# Altium project ESP_Infidel.PrjPcb
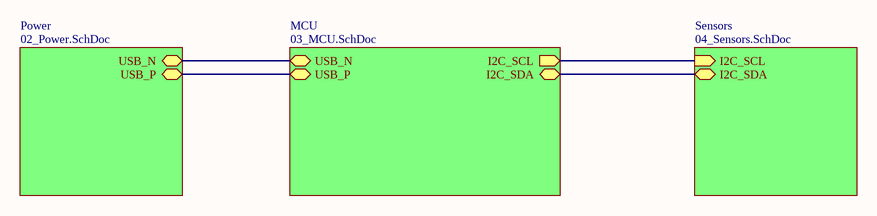
[diagram p0: 01_Top.SchDoc]
4 sheets, 47 parts. Net scope: hierarchical (ports join the sheet entries above them; power ports are global).
Board file: ESP_Infidel_PCB.PcbDoc
Sheets:
  01_Top.SchDoc
    Power = 02_Power.SchDoc
    MCU = 03_MCU.SchDoc
    Sensors = 04_Sensors.SchDoc

## Sheet 01_Top.SchDoc: OpenCamera Slider - Top level schematic
size A4; SheetNumber: 1; SheetTotal: 4; sk_ProjectName: WInFiDEL Sensor; sk_Title: Overview

### Sub-sheets
MCU = 03_MCU.SchDoc: USB_N (bidir), USB_P (bidir), I2C_SCL (out), I2C_SDA (bidir)
Power = 02_Power.SchDoc: USB_N (bidir), USB_P (bidir)
Sensors = 04_Sensors.SchDoc: I2C_SCL (in), I2C_SDA (bidir)

### Nets
I2C_SCL: sheet MCU/I2C_SCL, sheet Sensors/I2C_SCL
I2C_SDA: sheet MCU/I2C_SDA, sheet Sensors/I2C_SDA
USB_N: sheet Power/USB_P, sheet MCU/USB_P
USB_P: sheet Power/USB_N, sheet MCU/USB_N

### Notes on the sheet
- Page
- Title
- www.SasaKaranovic.com <http://www.SasaKaranovic.com>
- of

## Sheet 02_Power.SchDoc: OpenCamera Slider - Power
size A4; SheetNumber: 2; SheetTotal: 4; sk_ProjectName: WInFiDEL Sensor; sk_Title: Power and USB Connector
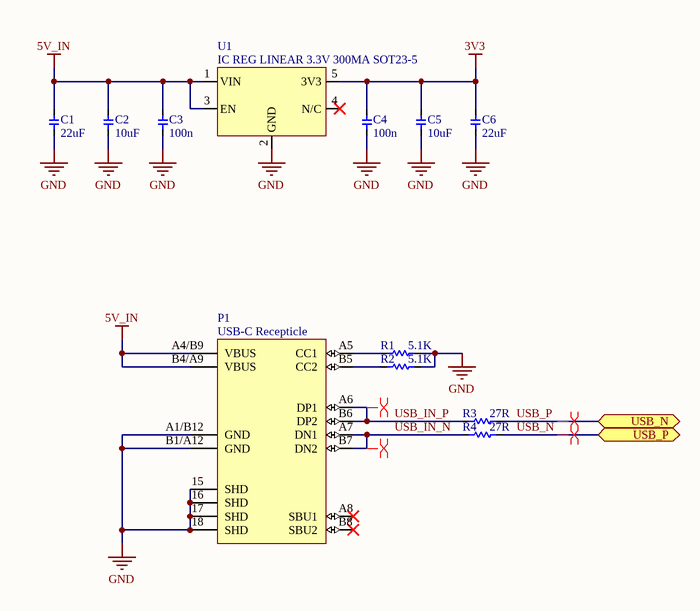
[diagram p1: 02_Power.SchDoc]

### Parts
C1  value 22uF  [0805]  (hidden comment: Cap)
C2  value 10uF  [0603 - CAP]  (hidden comment: Cap)
C3  value 100n  [0603 - CAP]  (hidden comment: Cap)
C4  value 100n  [0603 - CAP]  (hidden comment: Cap)
C5  value 10uF  [0603 - CAP]  (hidden comment: Cap)
C6  value 22uF  [0805]  (hidden comment: Cap)
P1  USB-C Recepticle  [GCT_USB4105-GF-A]
R1  value 5.1K  [0603]  (hidden comment: Res)
R2  value 5.1K  [0603]  (hidden comment: Res)
R3  value 27R  [0603]  (hidden comment: Res)
R4  value 27R  [0603]  (hidden comment: Res)
U1  IC REG LINEAR 3.3V 300MA SOT23-5  [SOT-23-5]

### Ports
USB_N (bidir), USB_P (bidir)

### Nets
3V3: C4.2 C5.2 C6.2 U1.5(3V3)
5V_IN: C1.2 C2.2 C3.2 P1.A4/B9(VBUS) P1.B4/A9(VBUS) U1.1(VIN) U1.3(EN)
GND: C1.1 C2.1 C3.1 C4.1 C5.1 C6.1 P1.15(SHD) P1.16(SHD) P1.17(SHD) P1.18(SHD) P1.A1/B12(GND) P1.B1/A12(GND) R1.2 R2.2 U1.2(GND)
USB_IN_N: P1.A7(DN1) P1.B7(DN2) R4.1
USB_IN_P: P1.A6(DP1) P1.B6(DP2) R3.1
USB_N: R4.2 ; port USB_P
USB_P: R3.2 ; port USB_N
NetP1_A5: P1.A5(CC1) R1.1
NetP1_B5: P1.B5(CC2) R2.1

Not connected (* = marked no-connect by the designer): P1 A8(SBU1)* B8(SBU2)*; U1 4(N/C)*

### Layout directives
differential pair: USB_IN_N, USB_IN_P, USB_N, USB_P

### Notes on the sheet
- Page
- Title
- www.SasaKaranovic.com <http://www.SasaKaranovic.com>
- of

### Library data of the parts
C1 C6 = Cap: Capacitor; Manufacturer: Samsung Electro-Mechanics; Manufacturer Part Number: CL21A226MAYNNNE; Voltage: 25V; Distributor Part Number: C602037; Distributor: LCSC
C2 C5 = Cap: Capacitor; Manufacturer: Samsung Electro-Mechanics; Manufacturer Part Number: CL21A106KAYNNNE; Voltage: 25V; Distributor Part Number: C15850; Distributor: LCSC
C3 C4 = Cap: Capacitor; Manufacturer: Samsung Electro-Mechanics; Manufacturer Part Number: CL10B104KB8NNNC; Voltage: 50V; Temp Rating: X7R; Distributor Part Number: C1591; Distributor: LCSC
P1 = USB-C Recepticle -USB-TYPE-C-019: 3A 1 Surface Mount 16P Female -25℃~+85℃ Type-C SMD USB Connectors ROHS; Manufacturer: DEALON; Manufacturer Part Number: USB-TYPE-C-019; Distributor Part Number: C2927039; Distributor: LCSC
R1 R2 = Res: Resistor; Manufacturer: YAGEO; Manufacturer Part Number: RC0603FR-075K1L; Power Rating: 100mW; Tolerance: 1%; Distributor: LCSC; Distributor Part Number: C105580
R3 R4 = Res: Resistor; Manufacturer: YAGEO; Manufacturer Part Number: RC0603FR-0727RL; Power Rating: 100mW; Tolerance: 1%; Distributor: LCSC; Distributor Part Number: C137753
U1 = AP7366-33W5-7: 600mA null 3.3V positive 6V SOT-25 Linear Voltage Regulators (LDO) ROHS; Manufacturer: Diodes Incorporated; Distributor: LCSC; Distributor Part Number: C526385; Manufacturer Part Number: AP7366-33W5-7

## Sheet 03_MCU.SchDoc: OpenCamera Slider - MCU
size A4; SheetNumber: 3; SheetTotal: 4; sk_ProjectName: WInFiDEL Sensor; sk_Title: Microcontroller
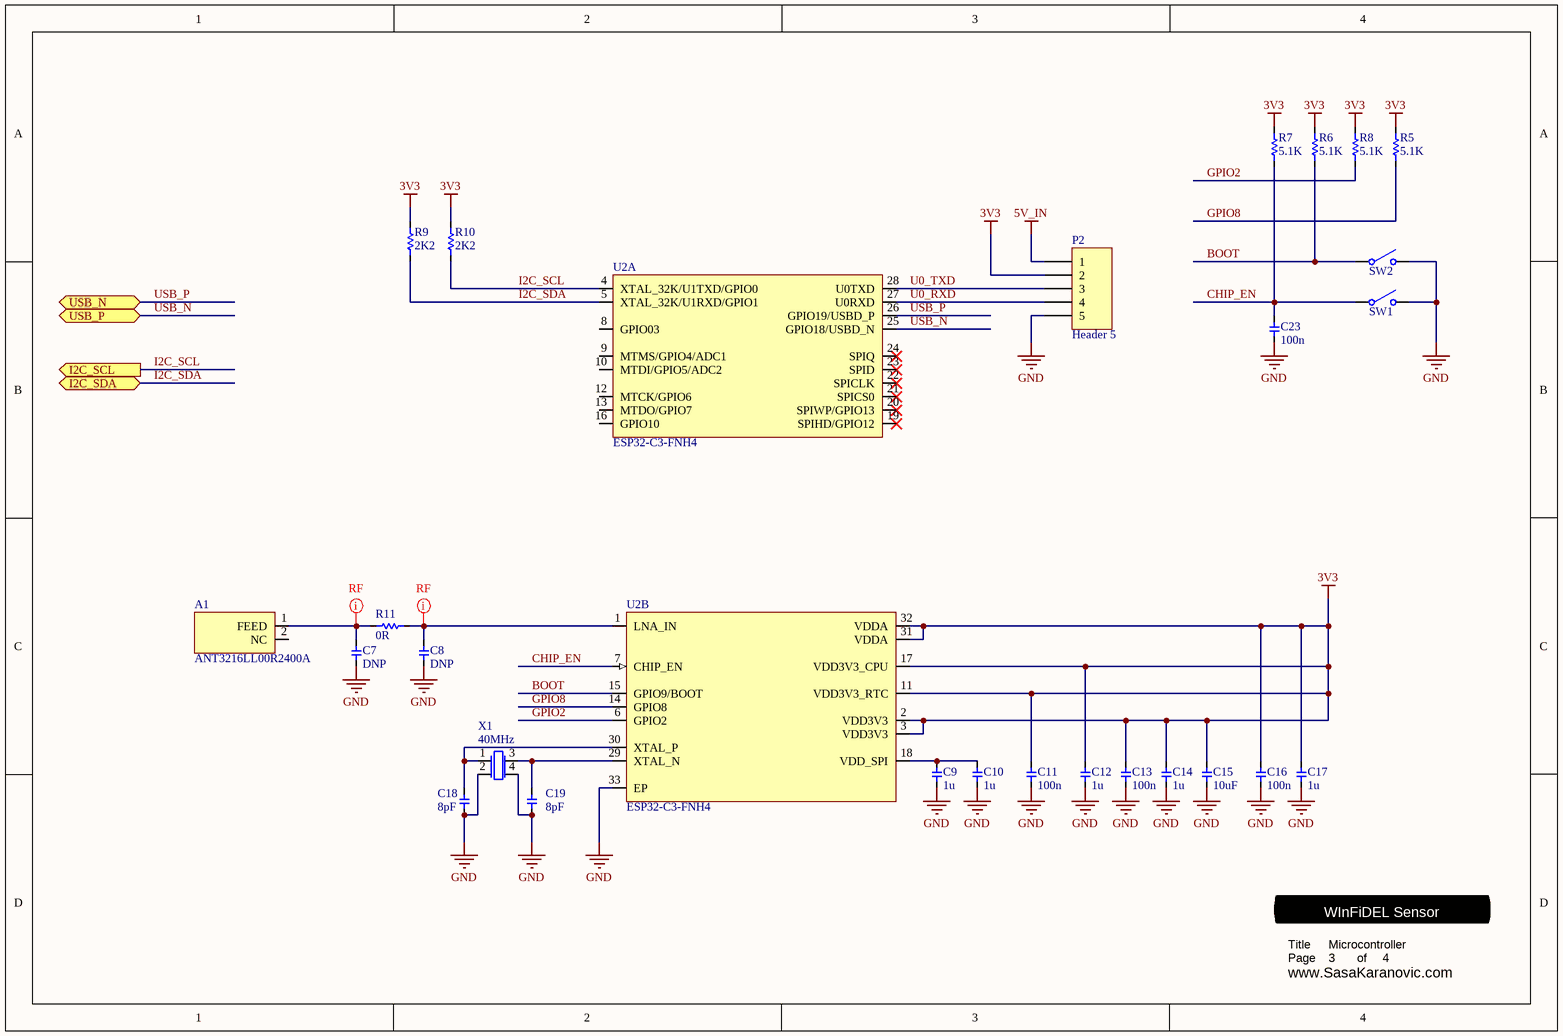
[diagram p2: 03_MCU.SchDoc]

### Parts
A1  ANT3216LL00R2400A  [ANT3216LL00R2400A]
C7  value DNP  [0603 - CAP]  (hidden comment: Cap)  (no BOM)
C8  value DNP  [0603 - CAP]  (hidden comment: Cap)  (no BOM)
C9  value 1u  [0603 - CAP]  (hidden comment: Cap)
C10  value 1u  [0603 - CAP]  (hidden comment: Cap)
C11  value 100n  [0603 - CAP]  (hidden comment: Cap)
C12  value 1u  [0603 - CAP]  (hidden comment: Cap)
C13  value 100n  [0603 - CAP]  (hidden comment: Cap)
C14  value 1u  [0603 - CAP]  (hidden comment: Cap)
C15  value 10uF  [0603 - CAP]  (hidden comment: Cap)
C16  value 100n  [0603 - CAP]  (hidden comment: Cap)
C17  value 1u  [0603 - CAP]  (hidden comment: Cap)
C18  value 8pF  [0603 - CAP]  (hidden comment: Cap)
C19  value 8pF  [0603 - CAP]  (hidden comment: Cap)
C23  value 100n  [0603 - CAP]  (hidden comment: Cap)
P2  Header 5  [Header 5x1]  (no BOM)
R5  value 5.1K  [0603]  (hidden comment: Res)
R6  value 5.1K  [0603]  (hidden comment: Res)
R7  value 5.1K  [0603]  (hidden comment: Res)
R8  value 5.1K  [0603]  (hidden comment: Res)
R9  value 2K2  [0603]  (hidden comment: Res)
R10  value 2K2  [0603]  (hidden comment: Res)
R11  value 0R  [0603]  (hidden comment: Res)
SW1  Switch  [Switch-XDTD-0304-215]  (value not drawn)
SW2  Switch  [Switch-XDTD-0304-215]  (value not drawn)
U2  ESP32-C3-FNH4  [QFN50P500X500X100_HS-33N]  (parts A,B of 2)
X1  40MHz  [XTAL-4LEAD-2016]

### Ports
I2C_SCL (out), I2C_SDA (bidir), USB_N (bidir), USB_P (bidir)

### Nets
3V3: C11.2 C12.2 C13.2 C14.2 C15.2 C16.2 C17.2 P2.2 R5.1 R6.1 R7.1 R8.1 R9.1 R10.1 U2.2(VDD3V3) U2.3(VDD3V3) U2.11(VDD3V3_RTC) U2.17(VDD3V3_CPU) U2.31(VDDA) U2.32(VDDA)
5V_IN: P2.1
GND: C7.1 C8.1 C9.1 C10.1 C11.1 C12.1 C13.1 C14.1 C15.1 C16.1 C17.1 C18.2 C19.1 C23.1 P2.5 SW1.2(COMMON2) SW2.2(COMMON2) U2.33(EP) X1.2(GND) X1.4(GND)
BOOT: R6.2 SW2.1(COMMON1) U2.15(GPIO9/BOOT)
CHIP_EN: C23.2 R7.2 SW1.1(COMMON1) U2.7(CHIP_EN)
GPIO2: R8.2 U2.6(GPIO2)
GPIO8: R5.2 U2.14(GPIO8)
I2C_SCL: R10.2 U2.4(XTAL_32K/U1TXD/GPIO0) ; port I2C_SCL
I2C_SDA: R9.2 U2.5(XTAL_32K/U1RXD/GPIO1) ; port I2C_SDA
U0_RXD: P2.4 U2.27(U0RXD)
U0_TXD: P2.3 U2.28(U0TXD)
USB_N: U2.25(GPIO18/USBD_N) ; port USB_P
USB_P: U2.26(GPIO19/USBD_P) ; port USB_N
NetA1_1: A1.1(FEED) C7.2 R11.1
NetC8_2: C8.2 R11.2 U2.1(LNA_IN)
NetC9_2: C9.2 C10.2 U2.18(VDD_SPI)
NetC18_1: C18.1 U2.30(XTAL_P) X1.1(OSC1)
NetC19_2: C19.2 U2.29(XTAL_N) X1.3(OSC3)

Not connected (* = marked no-connect by the designer): A1 2(NC); U2 8(GPIO03) 9(MTMS/GPIO4/ADC1) 10(MTDI/GPIO5/ADC2) 12(MTCK/GPIO6) 13(MTDO/GPIO7) 16(GPIO10) 19(SPIHD/GPIO12)* 20(SPIWP/GPIO13)* 21(SPICS0)* 22(SPICLK)* 23(SPID)* 24(SPIQ)*

### Layout directives
net class RF: NetA1_1, NetC8_2

### Notes on the sheet
- Page
- Title
- www.SasaKaranovic.com <http://www.SasaKaranovic.com>
- of

### Library data of the parts
A1 = ANT3216LL00R2400A: RF ANT 2.45GHZ CHIP SOLDER SMD; Manufacturer: YAGEO; Manufacturer Part Number: ANT3216LL00R2400A; Distributor: LCSC; Distributor Part Number: ANT3216LL00R2400A
C7 C8 = Cap: Capacitor
C9 C10 C12 C14 C17 = Cap: Capacitor; Manufacturer: YAGEO; Manufacturer Part Number: CC0603KRX7R9BB105; Temp Rating: X7R; Voltage: 50V; Distributor Part Number: C559769; Distributor: LCSC
C11 C13 C16 C23 = Cap: Capacitor; Manufacturer: Samsung Electro-Mechanics; Manufacturer Part Number: CL10B104KB8NNNC; Temp Rating: X7R; Voltage: 50V; Distributor Part Number: C1591; Distributor: LCSC
C15 = Cap: as C2 on sheet 02_Power; Distributor Part Number: C15850; Distributor: LCSC
C18 C19 = Cap: Capacitor; Manufacturer: YAGEO; Manufacturer Part Number: CC0603CRNPO9BN8R0; Temp Rating: NP0; Voltage: 50V; Distributor Part Number: C327316; Distributor: LCSC
P2 = Header 5: Header, 5-Pin
R5-R8 = Res: as R1 on sheet 02_Power; Distributor: LCSC; Distributor Part Number: C105580
R9 R10 = Res: Resistor; Manufacturer: YAGEO; Manufacturer Part Number: AC0603FR-072K2L; Power Rating: 100mW; Tolerance: 1%; Distributor: LCSC; Distributor Part Number: C125931
R11 = Res: Resistor; Manufacturer: YAGEO; Manufacturer Part Number: RC0603JR-070RL; Power Rating: 100mW; Tolerance: 5%; Distributor: LCSC; Distributor Part Number: C95177
SW1 SW2 = Switch -XDTD-0304-215: 50mA Surface Mount SPST 100MΩ 100,000 Times 12V 160gf@±50gf SMD Tactile Switches ROHS; Manufacturer: Lian Xin Technology; Manufacturer Part Number: XDTD-0304-215; Distributor: LCSC; Distributor Part Number: C7498203
U2 = ESP32-C3-FNH4: Ultra-Low-Power SoC with RISC-V Single-Core CPU 2.4 GHz Wi-Fi (802.11 b/g/n) and Bluetooth® 5 (LE); Manufacturer: Espressif Systems; Manufacturer Part Number: ESP32-C3FH4; Distributor: LCSC; Distributor Part Number: C2858491
X1 = XTAL-40MHz-R940000171: 40MHz 9pF ±10ppm SMD2016-4P Crystals ROHS; Manufacturer: TROQ; Manufacturer Part Number: R940000171; Distributor: LCSC; Distributor Part Number: C2929402

## Sheet 04_Sensors.SchDoc: ESPSense - Sensors
size A4; SheetNumber: 4; SheetTotal: 4; sk_ProjectName: WInFiDEL Sensor; sk_Title: Hall Sensor + ADC
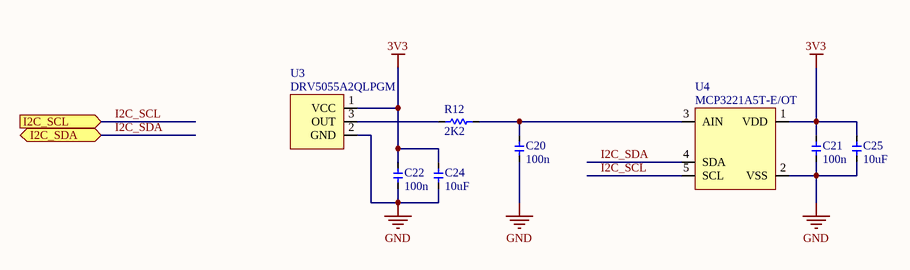
[diagram p3: 04_Sensors.SchDoc]

### Parts
C20  value 100n  [0603 - CAP]  (hidden comment: Cap)
C21  value 100n  [0603 - CAP]  (hidden comment: Cap)
C22  value 100n  [0603 - CAP]  (hidden comment: Cap)
C24  value 10uF  [0603 - CAP]  (hidden comment: Cap)
C25  value 10uF  [0603 - CAP]  (hidden comment: Cap)
R12  value 2K2  [0603]  (hidden comment: Res)
U3  DRV5055A2QLPGM  [SS490A]
U4  MCP3221A5T-E/OT  [SOT95P270X145-5N]

### Ports
I2C_SCL (in), I2C_SDA (bidir)

### Nets
3V3: C21.2 C22.2 C24.2 C25.2 U3.1(VCC) U4.1(VDD)
GND: C20.1 C21.1 C22.1 C24.1 C25.1 U3.2(GND) U4.2(VSS)
I2C_SCL: U4.5(SCL) ; port I2C_SCL
I2C_SDA: U4.4(SDA) ; port I2C_SDA
NetC20_2: C20.2 R12.2 U4.3(AIN)
NetR12_1: R12.1 U3.3(OUT)

### Notes on the sheet
- Page
- Title
- www.SasaKaranovic.com <http://www.SasaKaranovic.com>
- of

### Library data of the parts
C20-C22 = Cap: as C11 on sheet 03_MCU; Distributor Part Number: C1591; Distributor: LCSC
C24 C25 = Cap: as C2 on sheet 02_Power; Distributor Part Number: C15850; Distributor: LCSC
R12 = Res: as R9 on sheet 03_MCU; Distributor: LCSC; Distributor Part Number: C125931
U3 = DRV5055A2QLPGM: Hall Effect Sensor Single Axis Radial Lead; Manufacturer: Texas Instruments; Manufacturer Part Number: DRV5055A3QLPGM; Distributor: LCSC; Distributor Part Number: C266124
U4 = MCP3021A5T-E/OT: 10 Bit Analog to Digital Converter 1 Input 1 SAR SOT-23-5; Manufacturer: Microchip Technology; Manufacturer Part Number: MCP3221A5T-E/OT; Distributor: LCSC; Distributor Part Number: C625475

## Nets that join several sheets
3V3: 02_Power (C4.2 C5.2 C6.2 U1.5), 03_MCU (20 pins), 04_Sensors (6 pins)
5V_IN: 02_Power (7 pins), 03_MCU (P2.1)
GND: 02_Power (15 pins), 03_MCU (20 pins), 04_Sensors (7 pins)
I2C_SCL: 03_MCU (R10.2 U2.4), 04_Sensors (U4.5)
I2C_SDA: 03_MCU (R9.2 U2.5), 04_Sensors (U4.4)
USB_N: 02_Power (R4.2), 03_MCU (U2.25)
USB_P: 02_Power (R3.2), 03_MCU (U2.26)